# EAGLE schematic D9CD1423 (EAGLE 6.0)
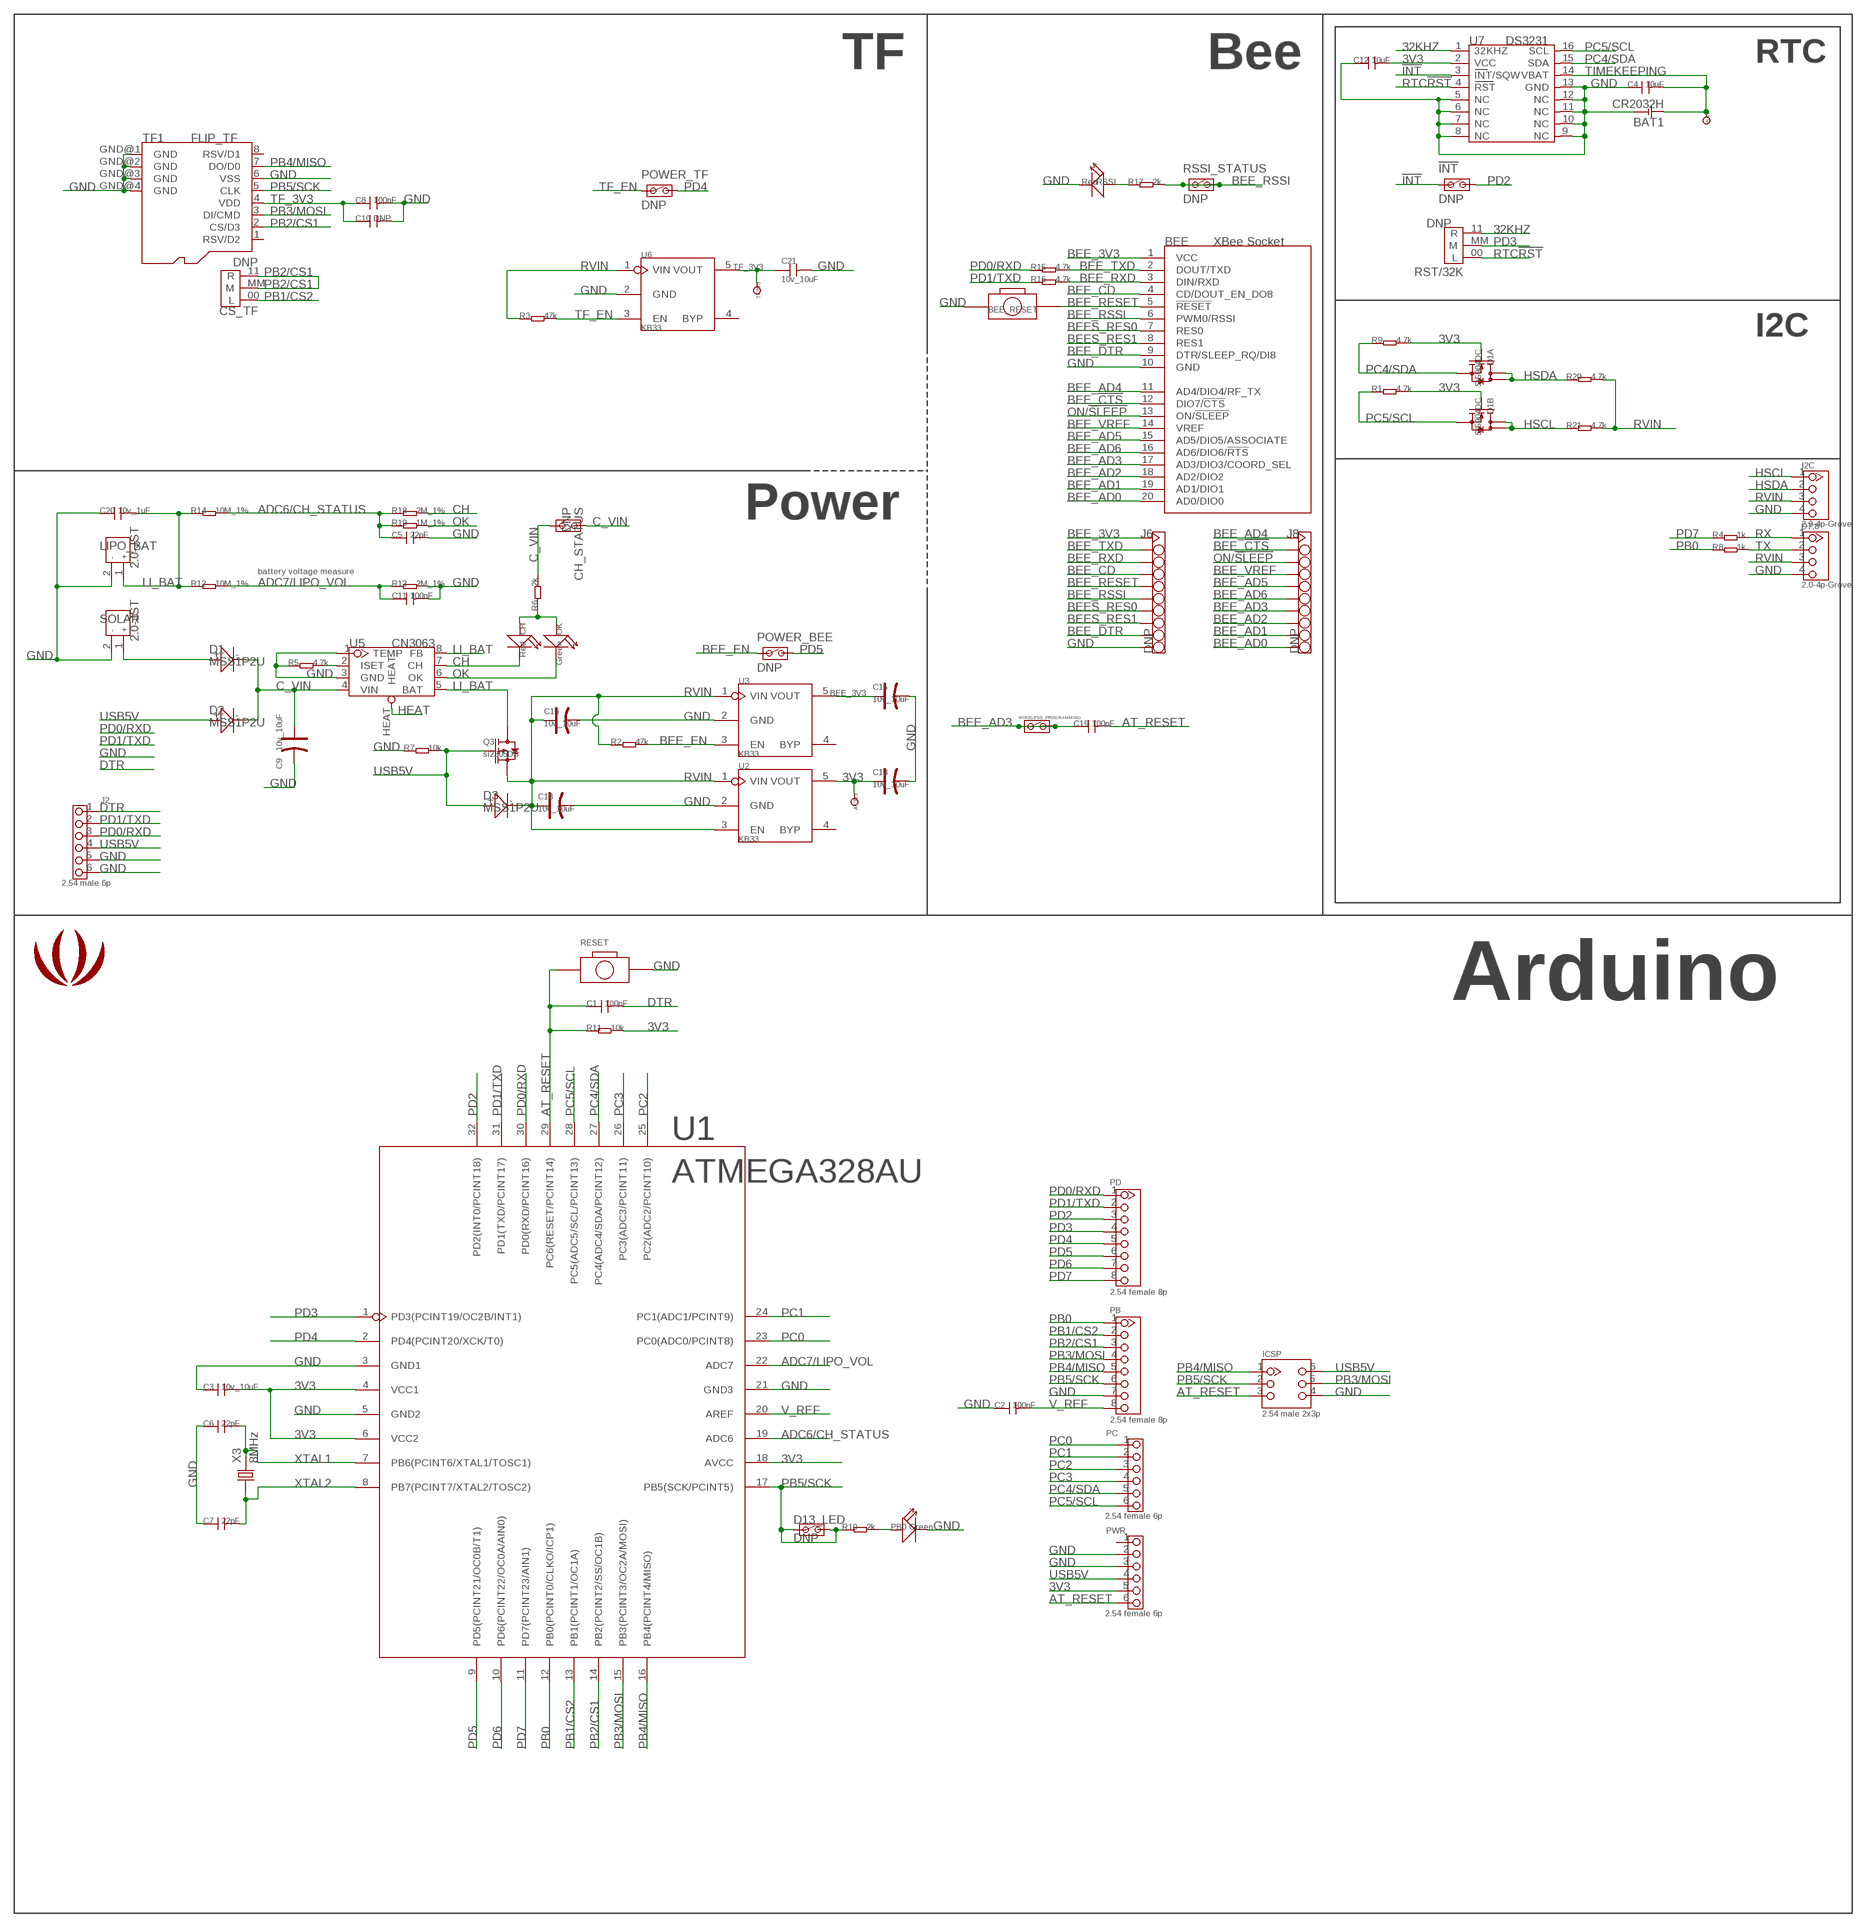
[diagram p0: schematic, sheet 1]

## Parts
!INT  DNP  JP_SW  [JP_SW]
AT3V3  DNP  TEST_POINT_SIZE_3030  [TP_3535]
BAT  DNP  TEST_POINT_SIZE_3030  [TP_3535]
BAT1  CR2032H  [CR2032H]
BEE  XBee Socket  BEEO  [BEE]
BEE_RESET  3.8x6.1 button  BOTTON_1_SMD  [BOTTON_1]
C1  100nF  C-0603  [0603]
C2  100nF  C-0603  [0603]
C3  10v_10uF  C-0805  [0805]
C4  10uF  C-0805  [0805]
C5  22pF  C-0603  [0603]
C6  22pF  C-0603  [0603]
C7  22pF  C-0603  [0603]
C8  100nF  C-0603  [0603]
C9  10v_10uF  CAP-AVX-A  [AVX-A]
C10  DNP  C-0603  [0603]
C11  100nF  C-0603  [0603]
C12  10uF  C-0805  [0805]
C13  10v_10uF  CAP-AVX-A  [AVX-A]
C15  10v_10uF  CAP-AVX-A  [AVX-A]
C16  10v_10uF  CAP-AVX-A  [AVX-A]
C18  10v_10uF  CAP-AVX-A  [AVX-A]
C19  100nF  C-0603  [0603]
C20  10v_1uF  C-0805  [0805]
C21  10v_10uF  C-0805  [0805]
CH  Red  007-LED0603  [D0603]
CH_STATUS  DNP  JP_SW  [JP_SW]
CS_TF  DNP  JUMPER  [JUMPER]
D1  MSS1P2U  010-DMSS1P2U  [D1005]
D2  MSS1P2U  010-DMSS1P2U  [D1005]
D3  MSS1P2U  010-DMSS1P2U  [D1005]
D7,8  2.0-4p-Grove  TWIG-4P-2.0-2.0  [4P-2.0]
D13_LED  DNP  JP_SW  [JP_SW]
I2C  2.0-4p-Grove  TWIG-4P-2.0-2.0  [4P-2.0]
ICSP  2.54 male 2x3p  HEADER-2X3P-2.54  [2X3P-2.54-LEADED]
J2  2.54 male 6p  HEADER-6P-LEADED-2.54  [6P-2.54-LEADED]
J6  DNP  HEADER_1X10DD  [HEADER_1X10]
J8  DNP  HEADER_1X10DD  [HEADER_1X10]
LIPO_BAT  2.0-JST  JACK-JST-2P-PW'2.0'  [JST-2.0]
LOGO1  LOGO  [LOGO_RO]
OK  Green  007-LED0603  [D0603]
PB  2.54 female 8p  HEADER-8P-2.54-LEADED  [8P-2.54-LEADED]
PB0  Green  007-LED0603  [D0603]
PC  2.54 female 6p  HEADER-6P-LEADED-2.54  [6P-2.54-LEADED]
PD  2.54 female 8p  HEADER-8P-2.54-LEADED  [8P-2.54-LEADED]
POWER_BEE  DNP  JP_SW  [JP_SW]
POWER_TF  DNP  JP_SW  [JP_SW]
PWR  2.54 female 6p  HEADER-6P-LEADED-2.54  [6P-2.54-LEADED]
Q1  Si5904DC  010-DUAL-N-MOSFET_1206-8  [1206-8]
Q3  si2305DS  010-P-MOSFETSOT23  [SOT23]
R1  4.7k  005-R0603  [0603@1]
R2  47k  005-R0603  [0603@1]
R3  47k  005-R0603  [0603@1]
R4  1k  005-R0603  [0603@1]
R5  4.7k  005-R0603  [0603@1]
R6  2k  005-R0603  [0603@1]
R7  10k  005-R0603  [0603@1]
R8  1k  005-R0603  [0603@1]
R9  4.7k  005-R0603  [0603@1]
R10  2k  005-R0603  [0603@1]
R11  10k  005-R0603  [0603@1]
R12  10M_1%  005-R0603  [0603@1]
R13  2M_1%  005-R0603  [0603@1]
R14  10M_1%  005-R0603  [0603@1]
R15  4.7k  005-R0603  [0603@1]
R16  4.7k  005-R0603  [0603@1]
R17  2k  005-R0603  [0603@1]
R18  2M_1%  005-R0603  [0603@1]
R19  1M_1%  005-R0603  [0603@1]
R20  4.7k  005-R0603  [0603@1]
R21  4.7k  005-R0603  [0603@1]
RESET  3.8x6.1 button  BOTTON_1_SMD  [BOTTON_1]
RSSI  Red  007-LED0603  [D0603]
RSSI_STATUS  DNP  JP_SW  [JP_SW]
RST/32K  DNP  JUMPER  [JUMPER]
SOLAR  2.0-JST  JACK-JST-2P-PW'2.0'  [JST-2.0]
TF1  FLIP_TF  [FLIP_TF]
TF3V3  DNP  TEST_POINT_SIZE_3030  [TP_3535]
U1  ATMEGA328AU  ATMEGA168-20AU  [ATMEGA168-20AU]
U2  KB33  MIC5025_X.X  [SOT23-5]
U3  KB33  MIC5025_X.X  [SOT23-5]
U5  CN3063  CN3083  [SOP8]
U6  KB33  MIC5025_X.X  [SOT23-5]
U7  DS3231  [SO16-W]
WIRELESS_PROGRAMMING  DNP  JP_SW  [JP_SW]
X3  8MHz  011-CRYSTALHC49S  [HC49/S]

## Nets
3V3: AT3V3.T C3.2 C12.2 C13.+ PWR.5 Q1.2(A:G) Q1.4(B:G) R1.2 R9.2 R11.2 U1.4(VCC1) U1.6(VCC2) U1.18(AVCC) U2.5(VOUT) U7.2(VCC)
32KHZ: RST/32K.11(R) U7.1(32KHZ)
!INT: !INT.1 U7.3(INT/SQW)
ADC6/CH_STATUS: C5.1 R14.2 R18.1 R19.1 U1.19(ADC6)
ADC7/LIPO_VOL: C11.1 R12.2 R13.1 U1.22(ADC7)
AT_RESET: C1.1 C19.2 ICSP.3 PWR.6 R11.1 RESET.1 U1.29(PC6(RESET/PCINT14))
BEE_3V3: BEE.1(VCC) C15.+ J6.1 U3.5(VOUT)
BEE_!CTS: BEE.12(DIO7/!CTS) J8.2
BEE_AD0: BEE.20(AD0/DIO0) J8.10
BEE_AD1: BEE.19(AD1/DIO1) J8.9
BEE_AD2: BEE.18(AD2/DIO2) J8.8
BEE_AD3: BEE.17(AD3/DIO3/COORD_SEL) C19.1 J8.7 WIRELESS_PROGRAMMING.1 WIRELESS_PROGRAMMING.2
BEE_AD4: BEE.11(AD4/DIO4/RF_TX) J8.1
BEE_AD5: BEE.15(AD5/DIO5/ASSOCIATE) J8.5
BEE_AD6: BEE.16(AD6/DIO6/!RTS) J8.6
BEE_CD: BEE.4(CD/DOUT_EN_DO8) J6.4
BEE_DTR: BEE.9(DTR/SLEEP_RQ/DI8) J6.9
BEE_EN: POWER_BEE.1 R2.2 U3.3(EN)
BEE_RESET: BEE.5(!RESET) BEE_RESET.P$2 J6.5
BEE_RSSI: BEE.6(PWM0/RSSI) J6.6 R17.2 RSSI_STATUS.1 RSSI_STATUS.2
BEE_RXD: BEE.3(DIN/RXD) J6.3 R16.2
BEE_TXD: BEE.2(DOUT/TXD) J6.2 R15.2
BEE_VREF: BEE.14(VREF) J8.4
BEES_RES0: BEE.7(RES0) J6.7
BEES_RES1: BEE.8(RES1) J6.8
C_VIN: C9.+ CH_STATUS.1 CH_STATUS.2 D1.- D2.- R6.2 U5.4(VIN)
CH: CH.- R18.2 U5.7(CH)
DTR: C1.2 J2.1
GND: BAT1.- BEE.10(GND) BEE_RESET.1 C2.1 C3.1 C4.1 C5.2 C6.1 C7.1 C8.2 C9.- C10.2 C11.2 C12.1 C13.- C15.- C16.- C18.- C20.1 C21.2 D7,8.4 I2C.4 ICSP.4 J2.5 J2.6 J6.10 LIPO_BAT.2 PB0.- PB.7 PWR.2 PWR.3 R5.1 R7.1 R13.2 RESET.P$2 RSSI.- SOLAR.2 TF1.6(VSS) TF1.GND@1(GND) TF1.GND@2(GND) TF1.GND@3(GND) TF1.GND@4(GND) U1.3(GND1) U1.5(GND2) U1.21(GND3) U2.2(GND) U3.2(GND) U5.1(TEMP) U5.3(GND) U6.2(GND) U7.5(NC) U7.6(NC) U7.7(NC) U7.8(NC) U7.9(NC) U7.10(NC) U7.11(NC) U7.12(NC) U7.13(GND)
HEAT: U5.HEAT
HSCL: I2C.1 Q1.5(B:D) Q1.6(B:D) R21.1
HSDA: I2C.2 Q1.7(A:D) Q1.8(A:D) R20.1
LI_BAT: C20.2 LIPO_BAT.1 Q3.3(D) R12.1 R14.1 U5.5(BAT) U5.8(FB)
N$1: PB0.+ R10.2
N$3: D1.+ SOLAR.1
N$5: R5.2 U5.2(ISET)
N$6: R17.1 RSSI.+
N$8: CH.+ OK.+ R6.1
OK: OK.- R19.2 U5.6(OK)
ON/!SLEEP: BEE.13(ON/!SLEEP) J8.3
PB0: PB.1 R8.1 U1.12(PB0(PCINT0/CLKO/ICP1))
PB1/CS2: CS_TF.00(L) PB.2 U1.13(PB1(PCINT1/OC1A))
PB2/CS1: CS_TF.11(R) CS_TF.MM(M) PB.3 TF1.2(CS/D3) U1.14(PB2(PCINT2/SS/OC1B))
PB3/MOSI: ICSP.5 PB.4 TF1.3(DI/CMD) U1.15(PB3(PCINT3/OC2A/MOSI))
PB4/MISO: ICSP.1 PB.5 TF1.7(DO/D0) U1.16(PB4(PCINT4/MISO))
PB5/SCK: D13_LED.1 D13_LED.2 ICSP.2 PB.6 R10.1 TF1.5(CLK) U1.17(PB5(SCK/PCINT5))
PC0: PC.1 U1.23(PC0(ADC0/PCINT8))
PC1: PC.2 U1.24(PC1(ADC1/PCINT9))
PC2: PC.3 U1.25(PC2(ADC2/PCINT10))
PC3: PC.4 U1.26(PC3(ADC3/PCINT11))
PC4/SDA: PC.5 Q1.1(A:S) R9.1 U1.27(PC4(ADC4/SDA/PCINT12)) U7.15(SDA)
PC5/SCL: PC.6 Q1.3(B:S) R1.1 U1.28(PC5(ADC5/SCL/PCINT13)) U7.16(SCL)
PD0/RXD: J2.3 PD.1 R15.1 U1.30(PD0(RXD/PCINT16))
PD1/TXD: J2.2 PD.2 R16.1 U1.31(PD1(TXD/PCINT17))
PD2: !INT.2 PD.3 U1.32(PD2(INT0/PCINT18))
PD3: PD.4 RST/32K.MM(M) U1.1(PD3(PCINT19/OC2B/INT1))
PD4: PD.5 POWER_TF.2 U1.2(PD4(PCINT20/XCK/T0))
PD5: PD.6 POWER_BEE.2 U1.9(PD5(PCINT21/OC0B/T1))
PD6: PD.7 U1.10(PD6(PCINT22/OC0A/AIN0))
PD7: PD.8 R4.1 U1.11(PD7(PCINT23/AIN1))
RTC!RST: RST/32K.00(L) U7.4(RST)
RVIN: C16.+ C18.+ D3.- D7,8.3 I2C.3 Q3.2(S) R2.1 R3.1 R20.2 R21.2 U2.1(VIN) U2.3(EN) U3.1(VIN) U6.1(VIN)
RX: D7,8.1 R4.2
TF_3V3: C8.1 C10.1 C21.1 TF1.4(VDD) TF3V3.T U6.5(VOUT)
TF_EN: POWER_TF.1 R3.2 U6.3(EN)
TIMEKEEPING: BAT1.+ BAT.T C4.2 U7.14(VBAT)
TX: D7,8.2 R8.2
USB5V: D2.+ D3.+ ICSP.6 J2.4 PWR.4 Q3.1(G) R7.2
V_REF: C2.2 PB.8 U1.20(AREF)
XTAL1: C6.2 U1.7(PB6(PCINT6/XTAL1/TOSC1)) X3.2
XTAL2: C7.2 U1.8(PB7(PCINT7/XTAL2/TOSC2)) X3.1
Unconnected: PWR.1 TF1.1(RSV/D2) TF1.8(RSV/D1) U2.4(BYP) U3.4(BYP) U6.4(BYP)

## Notes on the sheet
- TF | Bee | RTC
- I2C
- Power
- battery voltage measure
- Arduino

## Library data of the parts
!INT CH_STATUS D13_LED POWER_BEE POWER_TF RSSI_STATUS WIRELESS_PROGRAMMING = CPT_SMD:JP_SW
AT3V3 BAT TF3V3 = For_Test_Albert:TEST_POINT
BAT1 = BAT:CR2032H
BEE = EXT_moudle:BEE
BEE_RESET RESET = CPT_SMD:BOTTON_1
C1-C8 C10-C12 C19-C21 = Discrete:C*: Ceramic Capacitors
C9 C13 C15 C16 C18 = Discrete:CAP*: Electrolytic Capacitors,Tantalum Capacitors and Super Capacitors
CH OK PB0 RSSI = Discrete:007-LED*
CS_TF RST/32K = CPT_SMD:JUMPER
D1-D3 = Discrete:010-D*
D7,8 I2C = Connector:TWIG-4P-2.0
ICSP = Connector:HEADER-2X3P
J2 PC PWR = Connector:HEADER-6P
J6 J8 = CONNECTER:HEADER_1X10
LIPO_BAT SOLAR = Connector:JACK-JST-2P-PW
LOGO1 = logo:LOGO
PB PD = Connector:HEADER-8P
Q1 = Discrete:010-DUAL-N-MOSFET*: Si5902BDC Si5904DC Si5908DC Si5920DC
Q3 = Discrete:010-P-MOSFET*: Si2305DS Si2323CDS
R1-R21 = Discrete:005-R*
TF1 = Holders:FLIP_TF: http://garden.seeedstudio.com/images/e/e4/Flip_TF_Holder.jpg
U1 = IC_SMD:ATMEGA168-20AU
U2 U3 U6 = ICs_v54:MIC5025_X.X
U5 = ICs_v54:CN3083
U7 = IC:DS3231: Extremely Accurate I2C-Integrated RTC/TCXO/Crystal http://pdfserv.maxim-ic.com/en/ds/DS3231.pdf
X3 = Discrete:011-CRYSTAL*: CRYSTAL

## Net classes
0 default: width 0.152 mm, drill 0.305 mm, clearance 0.152 mm